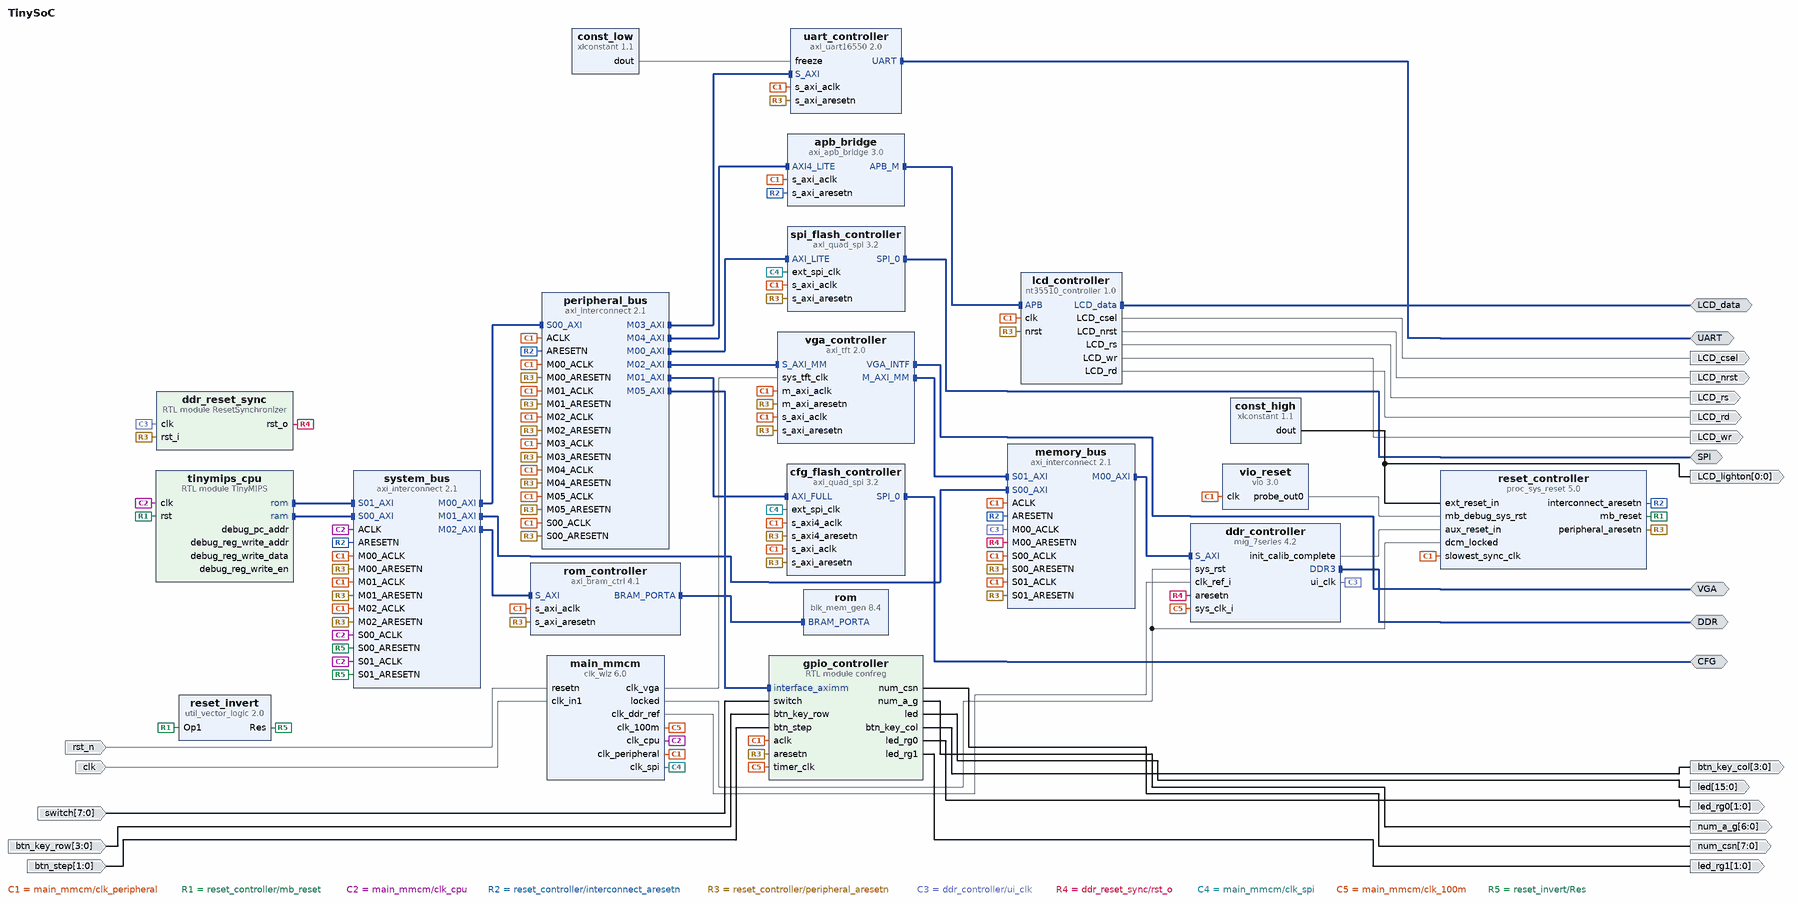
[diagram p0: block diagram of the top level]
# Vivado block design TinySoC, xc7a200tfbg676-2, Vivado 2018.3
create_bd_design TinySoC

create_bd_intf_port -mode Master -vlnv xilinx.com:interface:spi_rtl:1.0 SPI
create_bd_intf_port -mode Master -vlnv xilinx.com:interface:spi_rtl:1.0 CFG
create_bd_intf_port -mode Master -vlnv xilinx.com:interface:vga_rtl:1.0 VGA
create_bd_intf_port -mode Master -vlnv xilinx.com:interface:uart_rtl:1.0 UART
create_bd_intf_port -mode Master -vlnv xilinx.com:interface:ddrx_rtl:1.0 DDR
create_bd_intf_port -mode Master -vlnv xilinx.com:interface:gpio_rtl:1.0 LCD_data
create_bd_port -dir I -type rst rst_n
create_bd_port -dir I -type clk clk
set_property -dict {CONFIG.ASSOCIATED_RESET rst_n CONFIG.FREQ_HZ 100000000} [get_bd_ports clk]
create_bd_port -dir O LCD_nrst
create_bd_port -dir O LCD_rs
create_bd_port -dir O LCD_csel
create_bd_port -dir O LCD_wr
create_bd_port -dir O LCD_rd
create_bd_port -dir O -from 7 -to 0 num_csn
create_bd_port -dir O -from 6 -to 0 num_a_g
create_bd_port -dir O -from 15 -to 0 led
create_bd_port -dir O -from 1 -to 0 led_rg0
create_bd_port -dir O -from 1 -to 0 led_rg1
create_bd_port -dir O -from 3 -to 0 btn_key_col
create_bd_port -dir I -from 7 -to 0 switch
create_bd_port -dir I -from 3 -to 0 btn_key_row
create_bd_port -dir I -from 1 -to 0 btn_step
create_bd_port -dir O -from 0 -to 0 LCD_lighton

create_bd_cell -type ip -vlnv xilinx.com:ip:axi_interconnect:2.1 peripheral_bus
set_property -dict {CONFIG.NUM_MI 6 CONFIG.S00_HAS_DATA_FIFO 2 CONFIG.STRATEGY 2} [get_bd_cells peripheral_bus]
create_bd_cell -type ip -vlnv xilinx.com:ip:axi_interconnect:2.1 memory_bus
set_property -dict [list \
  CONFIG.NUM_MI 1 \
  CONFIG.NUM_SI 2 \
  CONFIG.S00_HAS_DATA_FIFO 2 \
  CONFIG.S01_HAS_DATA_FIFO 2 \
  CONFIG.STRATEGY 2 \
] [get_bd_cells memory_bus]
create_bd_cell -type ip -vlnv xilinx.com:ip:clk_wiz:6.0 main_mmcm
set_property -dict [list \
  CONFIG.CLKOUT1_JITTER 127.801 \
  CONFIG.CLKOUT1_PHASE_ERROR 87.180 \
  CONFIG.CLKOUT1_REQUESTED_OUT_FREQ 60.000 \
  CONFIG.CLKOUT2_JITTER 102.086 \
  CONFIG.CLKOUT2_PHASE_ERROR 87.180 \
  CONFIG.CLKOUT2_REQUESTED_OUT_FREQ 200.000 \
  CONFIG.CLKOUT2_USED true \
  CONFIG.CLKOUT3_JITTER 154.057 \
  CONFIG.CLKOUT3_PHASE_ERROR 87.180 \
  CONFIG.CLKOUT3_REQUESTED_OUT_FREQ 25.000 \
  CONFIG.CLKOUT3_USED true \
  CONFIG.CLKOUT4_JITTER 162.167 \
  CONFIG.CLKOUT4_PHASE_ERROR 87.180 \
  CONFIG.CLKOUT4_REQUESTED_OUT_FREQ 20.000 \
  CONFIG.CLKOUT4_USED true \
  CONFIG.CLKOUT5_JITTER 127.801 \
  CONFIG.CLKOUT5_PHASE_ERROR 87.180 \
  CONFIG.CLKOUT5_REQUESTED_OUT_FREQ 60.000 \
  CONFIG.CLKOUT5_USED true \
  CONFIG.CLKOUT6_JITTER 115.831 \
  CONFIG.CLKOUT6_PHASE_ERROR 87.180 \
  CONFIG.CLKOUT6_USED true \
  CONFIG.CLK_OUT1_PORT clk_cpu \
  CONFIG.CLK_OUT2_PORT clk_ddr_ref \
  CONFIG.CLK_OUT3_PORT clk_vga \
  CONFIG.CLK_OUT4_PORT clk_spi \
  CONFIG.CLK_OUT5_PORT clk_peripheral \
  CONFIG.CLK_OUT6_PORT clk_100m \
  CONFIG.MMCM_CLKFBOUT_MULT_F 12.000 \
  CONFIG.MMCM_CLKOUT0_DIVIDE_F 20.000 \
  CONFIG.MMCM_CLKOUT1_DIVIDE 6 \
  CONFIG.MMCM_CLKOUT2_DIVIDE 48 \
  CONFIG.MMCM_CLKOUT3_DIVIDE 60 \
  CONFIG.MMCM_CLKOUT4_DIVIDE 20 \
  CONFIG.MMCM_CLKOUT5_DIVIDE 12 \
  CONFIG.MMCM_DIVCLK_DIVIDE 1 \
  CONFIG.NUM_OUT_CLKS 6 \
  CONFIG.RESET_PORT resetn \
  CONFIG.RESET_TYPE ACTIVE_LOW \
] [get_bd_cells main_mmcm]
create_bd_cell -type ip -vlnv xilinx.com:ip:vio:3.0 vio_reset
set_property -dict {CONFIG.C_NUM_PROBE_IN 0} [get_bd_cells vio_reset]
create_bd_cell -type ip -vlnv xilinx.com:ip:proc_sys_reset:5.0 reset_controller
set_property -dict {CONFIG.C_AUX_RESET_HIGH 0} [get_bd_cells reset_controller]
create_bd_cell -type ip -vlnv xilinx.com:ip:xlconstant:1.1 const_low
set_property -dict {CONFIG.CONST_VAL 0} [get_bd_cells const_low]
create_bd_cell -type ip -vlnv xilinx.com:ip:util_vector_logic:2.0 reset_invert
set_property -dict {CONFIG.C_OPERATION not CONFIG.C_SIZE 1} [get_bd_cells reset_invert]
create_bd_cell -type ip -vlnv xilinx.com:ip:axi_tft:2.0 vga_controller
set_property -dict [list \
  CONFIG.C_DEFAULT_TFT_BASE_ADDR 0x0000000006000000 \
  CONFIG.C_EN_I2C_INTF 0 \
  CONFIG.C_MAX_BURST_LEN 128 \
  CONFIG.C_TFT_INTERFACE 0 \
] [get_bd_cells vga_controller]
create_bd_cell -type ip -vlnv xilinx.com:ip:axi_uart16550:2.0 uart_controller
create_bd_cell -type ip -vlnv xilinx.com:ip:mig_7series:4.2 ddr_controller
set_property -dict [list \
  CONFIG.BOARD_MIG_PARAM Custom \
  CONFIG.RESET_BOARD_INTERFACE Custom \
  CONFIG.XML_INPUT_FILE mig_a.prj \
] [get_bd_cells ddr_controller]
create_bd_cell -type ip -vlnv xilinx.com:ip:axi_quad_spi:3.2 spi_flash_controller
set_property -dict [list \
  CONFIG.C_FIFO_DEPTH 256 \
  CONFIG.C_SPI_MEMORY 2 \
  CONFIG.C_SPI_MODE 2 \
  CONFIG.C_USE_STARTUP 0 \
] [get_bd_cells spi_flash_controller]
create_bd_cell -type ip -vlnv xilinx.com:ip:axi_quad_spi:3.2 cfg_flash_controller
set_property -dict [list \
  CONFIG.C_SPI_MEMORY 3 \
  CONFIG.C_TYPE_OF_AXI4_INTERFACE 1 \
  CONFIG.C_XIP_MODE 1 \
] [get_bd_cells cfg_flash_controller]
create_bd_cell -type ip -vlnv harrychen.xyz:user:nt35510_controller:1.0 lcd_controller
create_bd_cell -type ip -vlnv xilinx.com:ip:axi_apb_bridge:3.0 apb_bridge
set_property -dict {CONFIG.C_APB_NUM_SLAVES 1 CONFIG.C_M_APB_PROTOCOL apb4} [get_bd_cells apb_bridge]
create_bd_cell -type ip -vlnv xilinx.com:ip:xlconstant:1.1 const_high
create_bd_cell -type module -reference TinyMIPS tinymips_cpu
create_bd_cell -type module -reference ResetSynchronizer ddr_reset_sync
create_bd_cell -type module -reference confreg gpio_controller
create_bd_cell -type ip -vlnv xilinx.com:ip:axi_bram_ctrl:4.1 rom_controller
set_property -dict {CONFIG.SINGLE_PORT_BRAM 1} [get_bd_cells rom_controller]
create_bd_cell -type ip -vlnv xilinx.com:ip:blk_mem_gen:8.4 rom
set_property -dict [list \
  CONFIG.Coe_File ../../../../boot.coe \
  CONFIG.EN_SAFETY_CKT false \
  CONFIG.Load_Init_File true \
  CONFIG.Memory_Type Single_Port_ROM \
  CONFIG.Port_A_Write_Rate 0 \
] [get_bd_cells rom]
create_bd_cell -type ip -vlnv xilinx.com:ip:axi_interconnect:2.1 system_bus
set_property -dict {CONFIG.NUM_MI 3 CONFIG.NUM_SI 2 CONFIG.STRATEGY 1} [get_bd_cells system_bus]

# ---- connections ----

connect_bd_intf_net [get_bd_intf_pins peripheral_bus/M01_AXI] [get_bd_intf_pins cfg_flash_controller/AXI_FULL]
connect_bd_intf_net [get_bd_intf_pins tinymips_cpu/rom] [get_bd_intf_pins system_bus/S01_AXI]
connect_bd_intf_net [get_bd_intf_pins peripheral_bus/M00_AXI] [get_bd_intf_pins spi_flash_controller/AXI_LITE]
connect_bd_intf_net [get_bd_intf_pins memory_bus/M00_AXI] [get_bd_intf_pins ddr_controller/S_AXI]
connect_bd_intf_net [get_bd_intf_ports DDR] [get_bd_intf_pins ddr_controller/DDR3]
connect_bd_intf_net -intf_net nt35510_controller_0_LCD_data [get_bd_intf_ports LCD_data] [get_bd_intf_pins lcd_controller/LCD_data]
connect_bd_intf_net [get_bd_intf_ports SPI] [get_bd_intf_pins spi_flash_controller/SPI_0]
connect_bd_intf_net [get_bd_intf_pins peripheral_bus/M04_AXI] [get_bd_intf_pins apb_bridge/AXI4_LITE]
connect_bd_intf_net [get_bd_intf_ports UART] [get_bd_intf_pins uart_controller/UART]
connect_bd_intf_net [get_bd_intf_ports CFG] [get_bd_intf_pins cfg_flash_controller/SPI_0]
connect_bd_intf_net [get_bd_intf_pins peripheral_bus/M02_AXI] [get_bd_intf_pins vga_controller/S_AXI_MM]
connect_bd_intf_net -intf_net axi_apb_bridge_0_APB_M [get_bd_intf_pins apb_bridge/APB_M] [get_bd_intf_pins lcd_controller/APB]
connect_bd_intf_net [get_bd_intf_pins peripheral_bus/M05_AXI] [get_bd_intf_pins gpio_controller/interface_aximm]
connect_bd_intf_net [get_bd_intf_pins system_bus/M00_AXI] [get_bd_intf_pins peripheral_bus/S00_AXI]
connect_bd_intf_net [get_bd_intf_pins system_bus/M01_AXI] [get_bd_intf_pins memory_bus/S00_AXI]
connect_bd_intf_net [get_bd_intf_ports VGA] [get_bd_intf_pins vga_controller/VGA_INTF]
connect_bd_intf_net [get_bd_intf_pins tinymips_cpu/ram] [get_bd_intf_pins system_bus/S00_AXI]
connect_bd_intf_net [get_bd_intf_pins system_bus/M02_AXI] [get_bd_intf_pins rom_controller/S_AXI]
connect_bd_intf_net [get_bd_intf_pins vga_controller/M_AXI_MM] [get_bd_intf_pins memory_bus/S01_AXI]
connect_bd_intf_net [get_bd_intf_pins rom_controller/BRAM_PORTA] [get_bd_intf_pins rom/BRAM_PORTA]
connect_bd_intf_net [get_bd_intf_pins peripheral_bus/M03_AXI] [get_bd_intf_pins uart_controller/S_AXI]
connect_bd_net [get_bd_ports rst_n] [get_bd_pins main_mmcm/resetn]
connect_bd_net [get_bd_ports clk] [get_bd_pins main_mmcm/clk_in1]
connect_bd_net [get_bd_pins main_mmcm/clk_peripheral] \
  [get_bd_pins vio_reset/clk] [get_bd_pins peripheral_bus/ACLK] [get_bd_pins memory_bus/ACLK] \
  [get_bd_pins memory_bus/S00_ACLK] [get_bd_pins memory_bus/S01_ACLK] [get_bd_pins peripheral_bus/S00_ACLK] \
  [get_bd_pins peripheral_bus/M00_ACLK] [get_bd_pins peripheral_bus/M01_ACLK] [get_bd_pins spi_flash_controller/s_axi_aclk] \
  [get_bd_pins uart_controller/s_axi_aclk] [get_bd_pins vga_controller/s_axi_aclk] [get_bd_pins vga_controller/m_axi_aclk] \
  [get_bd_pins peripheral_bus/M02_ACLK] [get_bd_pins peripheral_bus/M03_ACLK] [get_bd_pins peripheral_bus/M04_ACLK] \
  [get_bd_pins peripheral_bus/M05_ACLK] [get_bd_pins cfg_flash_controller/s_axi_aclk] \
  [get_bd_pins cfg_flash_controller/s_axi4_aclk] [get_bd_pins apb_bridge/s_axi_aclk] [get_bd_pins lcd_controller/clk] \
  [get_bd_pins reset_controller/slowest_sync_clk] [get_bd_pins gpio_controller/aclk] [get_bd_pins rom_controller/s_axi_aclk] \
  [get_bd_pins system_bus/M00_ACLK] [get_bd_pins system_bus/M01_ACLK] [get_bd_pins system_bus/M02_ACLK]
connect_bd_net [get_bd_pins vio_reset/probe_out0] [get_bd_pins reset_controller/mb_debug_sys_rst]
connect_bd_net [get_bd_pins main_mmcm/locked] [get_bd_pins reset_controller/dcm_locked] [get_bd_pins ddr_controller/sys_rst]
connect_bd_net [get_bd_pins reset_controller/mb_reset] [get_bd_pins reset_invert/Op1] [get_bd_pins tinymips_cpu/rst]
connect_bd_net [get_bd_pins main_mmcm/clk_cpu] \
  [get_bd_pins tinymips_cpu/clk] [get_bd_pins system_bus/S00_ACLK] [get_bd_pins system_bus/S01_ACLK] \
  [get_bd_pins system_bus/ACLK]
connect_bd_net [get_bd_pins reset_controller/interconnect_aresetn] \
  [get_bd_pins peripheral_bus/ARESETN] [get_bd_pins memory_bus/ARESETN] [get_bd_pins apb_bridge/s_axi_aresetn] \
  [get_bd_pins system_bus/ARESETN]
connect_bd_net [get_bd_pins reset_controller/peripheral_aresetn] \
  [get_bd_pins memory_bus/S00_ARESETN] [get_bd_pins memory_bus/S01_ARESETN] [get_bd_pins peripheral_bus/S00_ARESETN] \
  [get_bd_pins peripheral_bus/M00_ARESETN] [get_bd_pins peripheral_bus/M01_ARESETN] \
  [get_bd_pins spi_flash_controller/s_axi_aresetn] [get_bd_pins uart_controller/s_axi_aresetn] \
  [get_bd_pins vga_controller/s_axi_aresetn] [get_bd_pins vga_controller/m_axi_aresetn] \
  [get_bd_pins peripheral_bus/M02_ARESETN] [get_bd_pins peripheral_bus/M03_ARESETN] [get_bd_pins peripheral_bus/M04_ARESETN] \
  [get_bd_pins peripheral_bus/M05_ARESETN] [get_bd_pins cfg_flash_controller/s_axi_aresetn] \
  [get_bd_pins cfg_flash_controller/s_axi4_aresetn] [get_bd_pins lcd_controller/nrst] [get_bd_pins ddr_reset_sync/rst_i] \
  [get_bd_pins gpio_controller/aresetn] [get_bd_pins rom_controller/s_axi_aresetn] [get_bd_pins system_bus/M00_ARESETN] \
  [get_bd_pins system_bus/M01_ARESETN] [get_bd_pins system_bus/M02_ARESETN]
connect_bd_net [get_bd_pins ddr_controller/ui_clk] [get_bd_pins memory_bus/M00_ACLK] [get_bd_pins ddr_reset_sync/clk]
connect_bd_net [get_bd_pins ddr_reset_sync/rst_o] [get_bd_pins ddr_controller/aresetn] [get_bd_pins memory_bus/M00_ARESETN]
connect_bd_net [get_bd_pins main_mmcm/clk_spi] [get_bd_pins spi_flash_controller/ext_spi_clk] [get_bd_pins cfg_flash_controller/ext_spi_clk]
connect_bd_net [get_bd_pins main_mmcm/clk_vga] [get_bd_pins vga_controller/sys_tft_clk]
connect_bd_net -net nt35510_controller_0_LCD_nrst [get_bd_pins lcd_controller/LCD_nrst] [get_bd_ports LCD_nrst]
connect_bd_net -net nt35510_controller_0_LCD_rs [get_bd_pins lcd_controller/LCD_rs] [get_bd_ports LCD_rs]
connect_bd_net -net nt35510_controller_0_LCD_csel [get_bd_pins lcd_controller/LCD_csel] [get_bd_ports LCD_csel]
connect_bd_net -net nt35510_controller_0_LCD_wr [get_bd_pins lcd_controller/LCD_wr] [get_bd_ports LCD_wr]
connect_bd_net -net nt35510_controller_0_LCD_rd [get_bd_pins lcd_controller/LCD_rd] [get_bd_ports LCD_rd]
connect_bd_net [get_bd_pins gpio_controller/num_csn] [get_bd_ports num_csn]
connect_bd_net [get_bd_pins gpio_controller/num_a_g] [get_bd_ports num_a_g]
connect_bd_net [get_bd_pins gpio_controller/led] [get_bd_ports led]
connect_bd_net [get_bd_pins gpio_controller/led_rg0] [get_bd_ports led_rg0]
connect_bd_net [get_bd_pins gpio_controller/led_rg1] [get_bd_ports led_rg1]
connect_bd_net [get_bd_pins gpio_controller/btn_key_col] [get_bd_ports btn_key_col]
connect_bd_net -net switch_0_1 [get_bd_ports switch] [get_bd_pins gpio_controller/switch]
connect_bd_net -net btn_key_row_0_1 [get_bd_ports btn_key_row] [get_bd_pins gpio_controller/btn_key_row]
connect_bd_net -net btn_step_0_1 [get_bd_ports btn_step] [get_bd_pins gpio_controller/btn_step]
connect_bd_net [get_bd_pins const_low/dout] [get_bd_pins uart_controller/freeze]
connect_bd_net [get_bd_pins const_high/dout] [get_bd_pins reset_controller/ext_reset_in] [get_bd_ports LCD_lighton]
connect_bd_net [get_bd_pins main_mmcm/clk_ddr_ref] [get_bd_pins ddr_controller/clk_ref_i]
connect_bd_net [get_bd_pins main_mmcm/clk_100m] [get_bd_pins ddr_controller/sys_clk_i] [get_bd_pins gpio_controller/timer_clk]
# net debug_reg_write_en has one end: tinymips_cpu/debug_reg_write_en
# net debug_reg_write_addr has one end: tinymips_cpu/debug_reg_write_addr
# net debug_reg_write_data has one end: tinymips_cpu/debug_reg_write_data
# net debug_pc_addr has one end: tinymips_cpu/debug_pc_addr
connect_bd_net -net S00_ARESETN_1 [get_bd_pins reset_invert/Res] [get_bd_pins system_bus/S00_ARESETN] [get_bd_pins system_bus/S01_ARESETN]
connect_bd_net [get_bd_pins ddr_controller/init_calib_complete] [get_bd_pins reset_controller/aux_reset_in]
set_property HDL_ATTRIBUTE.DEBUG true [get_bd_nets debug_reg_write_en]
set_property HDL_ATTRIBUTE.MARK_DEBUG true [get_bd_nets debug_reg_write_en]
set_property HDL_ATTRIBUTE.DEBUG true [get_bd_nets debug_reg_write_addr]
set_property HDL_ATTRIBUTE.MARK_DEBUG true [get_bd_nets debug_reg_write_addr]
set_property HDL_ATTRIBUTE.DEBUG true [get_bd_nets debug_reg_write_data]
set_property HDL_ATTRIBUTE.MARK_DEBUG true [get_bd_nets debug_reg_write_data]
set_property HDL_ATTRIBUTE.DEBUG true [get_bd_nets debug_pc_addr]
set_property HDL_ATTRIBUTE.MARK_DEBUG true [get_bd_nets debug_pc_addr]

# ---- address map ----
assign_bd_address -offset 0x00000000 -range 128M -target_address_space [get_bd_addr_spaces tinymips_cpu/ram] [get_bd_addr_segs ddr_controller/memmap/memaddr]
assign_bd_address -offset 0x1A000000 -range 16M -target_address_space [get_bd_addr_spaces tinymips_cpu/ram] [get_bd_addr_segs cfg_flash_controller/aximm/MEM0]
assign_bd_address -offset 0x1C000000 -range 4K -target_address_space [get_bd_addr_spaces tinymips_cpu/ram] [get_bd_addr_segs spi_flash_controller/AXI_LITE/Reg]
assign_bd_address -offset 0x1C010000 -range 64K -target_address_space [get_bd_addr_spaces tinymips_cpu/ram] [get_bd_addr_segs vga_controller/S_AXI_MM/Reg]
assign_bd_address -offset 0x1C020000 -range 8K -target_address_space [get_bd_addr_spaces tinymips_cpu/ram] [get_bd_addr_segs uart_controller/S_AXI/Reg]
assign_bd_address -offset 0x1C030000 -range 4K -target_address_space [get_bd_addr_spaces tinymips_cpu/ram] [get_bd_addr_segs lcd_controller/APB/Reg]
assign_bd_address -offset 0x1C040000 -range 64K -target_address_space [get_bd_addr_spaces tinymips_cpu/ram] [get_bd_addr_segs gpio_controller/interface_aximm/reg0]
assign_bd_address -offset 0x1FC00000 -range 32K -target_address_space [get_bd_addr_spaces tinymips_cpu/ram] [get_bd_addr_segs rom_controller/S_AXI/Mem0]
assign_bd_address -offset 0x00000000 -range 128M -target_address_space [get_bd_addr_spaces tinymips_cpu/rom] [get_bd_addr_segs ddr_controller/memmap/memaddr]
assign_bd_address -offset 0x1A000000 -range 16M -target_address_space [get_bd_addr_spaces tinymips_cpu/rom] [get_bd_addr_segs cfg_flash_controller/aximm/MEM0]
assign_bd_address -offset 0x1C000000 -range 4K -target_address_space [get_bd_addr_spaces tinymips_cpu/rom] [get_bd_addr_segs spi_flash_controller/AXI_LITE/Reg]
assign_bd_address -offset 0x1C010000 -range 64K -target_address_space [get_bd_addr_spaces tinymips_cpu/rom] [get_bd_addr_segs vga_controller/S_AXI_MM/Reg]
assign_bd_address -offset 0x1C020000 -range 8K -target_address_space [get_bd_addr_spaces tinymips_cpu/rom] [get_bd_addr_segs uart_controller/S_AXI/Reg]
assign_bd_address -offset 0x1C030000 -range 4K -target_address_space [get_bd_addr_spaces tinymips_cpu/rom] [get_bd_addr_segs lcd_controller/APB/Reg]
assign_bd_address -offset 0x1C040000 -range 64K -target_address_space [get_bd_addr_spaces tinymips_cpu/rom] [get_bd_addr_segs gpio_controller/interface_aximm/reg0]
assign_bd_address -offset 0x1FC00000 -range 32K -target_address_space [get_bd_addr_spaces tinymips_cpu/rom] [get_bd_addr_segs rom_controller/S_AXI/Mem0]
assign_bd_address -offset 0x00000000 -range 128M -target_address_space [get_bd_addr_spaces vga_controller/Video_data] [get_bd_addr_segs ddr_controller/memmap/memaddr]

validate_bd_design
save_bd_design
